# EAGLE design sensors_f (EAGLE 9.6.2)
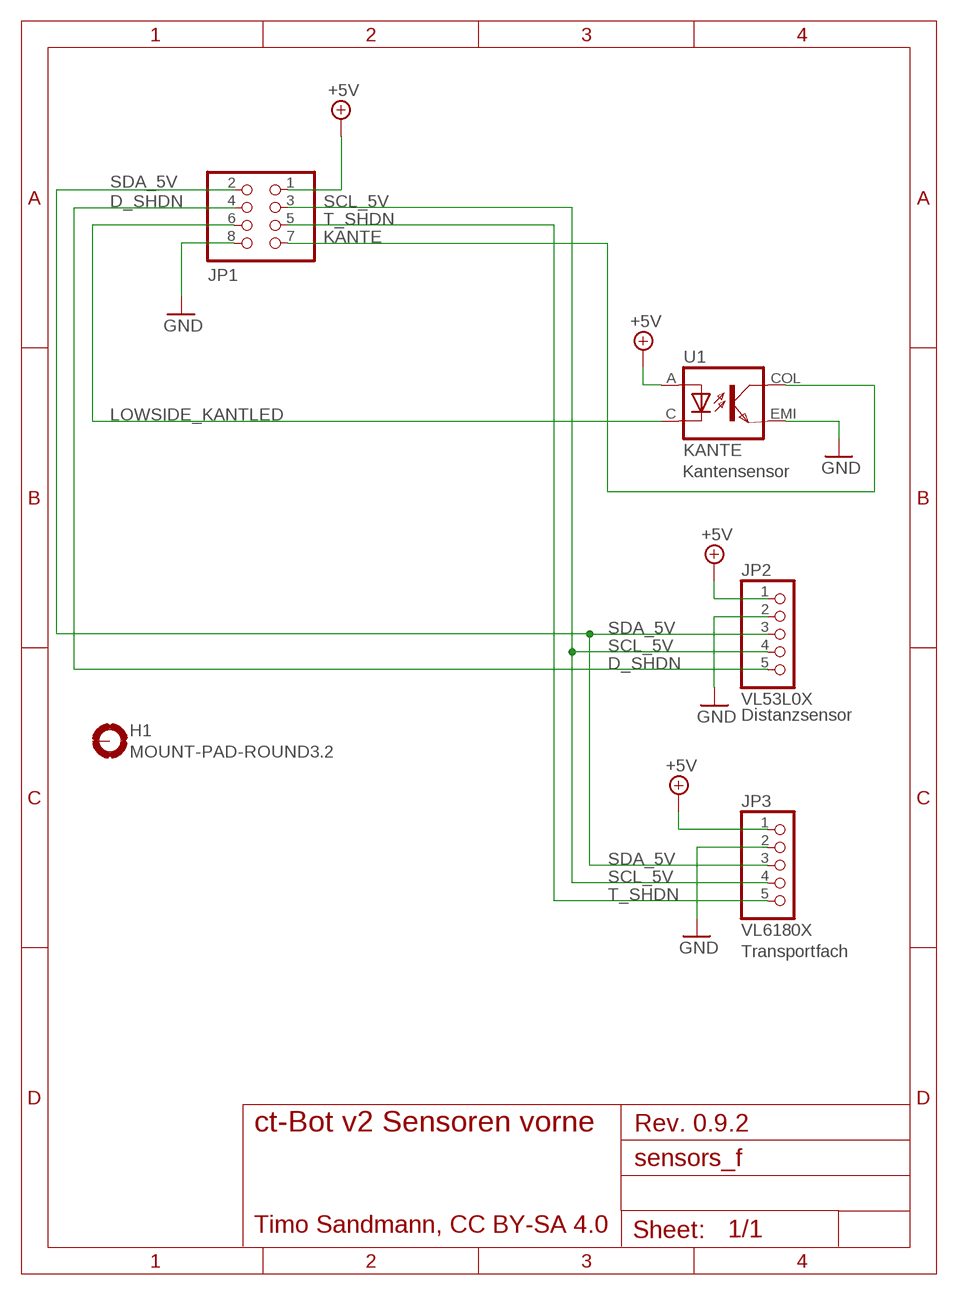
[diagram p0: schematic, sheet 1]

## Parts
H1  MOUNT-PAD-ROUND3.2  [3,2-PAD]
JP1  PINHD-2X4  [2X04]
JP2  VL53L0X  PINHD-1X5  [1X05]
JP3  VL6180X  PINHD-1X5  [1X05]
U1  KANTE  CNY70  [EDGE]

## Nets
+5V: JP1.1 JP2.1 JP3.1 U1.A
D_SHDN: JP1.4 JP2.5
GND: JP1.8 JP2.2 JP3.2 U1.EMI
KANTE: JP1.7 U1.COL
LOWSIDE_KANTLED: JP1.6 U1.C
SCL_5V: JP1.3 JP2.4 JP3.4
SDA_5V: JP1.2 JP2.3 JP3.3
T_SHDN: JP1.5 JP3.5
Unconnected: H1.B3,2(MOUNT)

## Notes on the sheet
- Kantensensor
- Distanzsensor
- Transportfach
- Rev. 0.9.2
- ct-Bot v2 Sensoren vorne
- Timo Sandmann, CC BY-SA 4.0

## Library data of the parts
H1 = holes:MOUNT-PAD-ROUND: MOUNTING PAD, round
JP1 = ct-bot:PINHD-2X4: PIN HEADER
JP2 JP3 = ct-bot:PINHD-1X5: PIN HEADER
U1 = ct-bot:CNY70

## Board
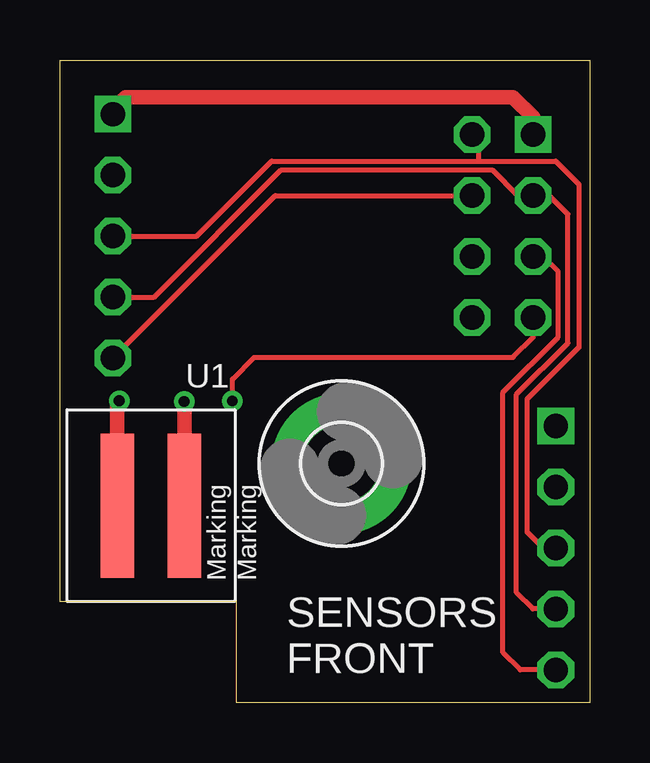
[diagram p1: board, top side]
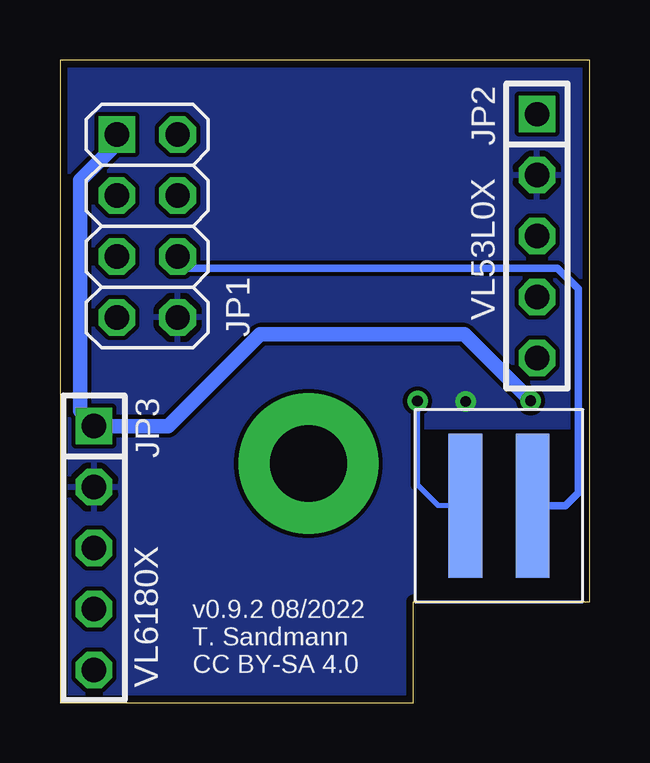
[diagram p2: board, bottom side, seen from below]

Size 22.1 x 26.77 mm. Coordinates in mm from the lower left corner, seen from the top.
Outline: 22.1,0 7.37,0 7.37,4.19 0,4.19 0,26.77 22.1,26.77 22.1,0
Copper layers (1*16): Top 0.035mm / dielectric 1.5mm / Bottom 0.035mm
Design rules "aisler_2_layer_simple": minimum track width 0.2mm, minimum drill 0.45mm, track to track 0.175mm, track to pad 0.175mm, pad to pad 0.175mm, via to via 0.175mm, smd to smd 0.175mm, copper to edge 0.3mm, drill to drill 0.25mm, minimum pad ring 0.2mm, minimum via ring 0.2mm, stop-mask expansion 0mil, vias tented up to drill 0mil, thermal gap 10mil

### Footprints (pad centres in the part's own frame; a part is rotated, then mirrored left to right if it is on the bottom)
3,2-PAD = drill 3.2 pad 5.842: B3,2 0,0
2X04 = drill 1.016 square: 1 -3.81,-1.27 | drill 1.016 octagon: 2 -3.81,1.27; 3 -1.27,-1.27; 4 -1.27,1.27; 5 1.27,-1.27; 6 1.27,1.27; 7 3.81,-1.27; 8 3.81,1.27
1X05 = drill 1.016 square: 1 -5.08,0 | drill 1.016 octagon: 2 -2.54,0; 3 0,0; 4 2.54,0; 5 5.08,0
EDGE = smd 1.4 x 6: A 0,0; EMI 2.8,0 | smd 1.4 x 6 bottom: C 0,0; COL 2.8,0

### Placement (x,y rotation side)
H1  11.74,9.96 0 top
JP1  18.46,19.85 270 bottom
JP2  2.2,19.43 270 bottom
JP3  20.68,6.44 270 bottom
U1  2.39,8.21 0 top

### Tracks (layer width: path | path; a pad name or v marks a point on that pad's centre or on a via)
+5V  (via drill 0.45)
  Top 0.61: U1.A 2.39,12.5 v2.47,12.57 | JP2.1 2.2,24.7 2.73,25.23 18.88,25.23 19.73,24.38 JP1.1
  Bottom 0.61: JP1.1 19.73,23.29 21.27,21.76 21.27,12.16 20.68,11.57 JP3.1 17.58,11.52 13.75,15.34 5.24,15.34 v2.47,12.57
D_SHDN
  Top 0.203: JP2.5 8.97,21.12 JP1.4
GND  (via drill 0.45)
  Top 0.61: U1.EMI 5.19,12.53 v5.18,12.54
  pour Bottom (rank 6): 22.63,27.1 -0.46,27.1 -0.46,-0.29 22.63,-0.29
KANTE  (via drill 0.45)
  Top 0.203: v7.19,12.56 7.19,13.48 8.09,14.38 18.89,14.38 19.73,15.22 JP1.7
  Bottom 0.203: U1.COL 6.32,8.21 7.19,9.08 v7.19,12.56
LOWSIDE_KANTLED
  Bottom 0.305: U1.C 1.02,8.21 0.49,8.74 0.49,17.23 1.35,18.09 16.88,18.09 17.19,18.4 JP1.6
N$1
  cutout Bottom: 7.24,11.3 0.28,11.3 0.28,4.21 7.24,4.21
SCL_5V
  Top 0.203: JP2.4 3.92,16.89 9.19,22.17 18.06,22.17 19.1,21.12 JP1.3 20.4,21.12 21.18,20.35 21.18,14.97 19.04,12.83 19.04,4.58 19.72,3.9 JP3.4
SDA_5V
  Top 0.203: JP3.3 20.16,6.44 19.48,7.12 19.48,12.64 21.64,14.8 21.64,21.59 20.67,22.56 17.44,22.56 | 17.44,22.56 8.83,22.56 5.71,19.43 JP2.3 | JP1.2 17.44,23.41 17.44,22.56
T_SHDN
  Top 0.203: JP3.5 19.19,1.36 18.47,2.08 18.47,12.93 20.77,15.23 20.77,17.95 20.14,18.58 JP1.5

### Text on the board
tNames: SENSORS / FRONT
bNames: VL53L0X | v0.9.2 08/2022 / T. Sandmann / CC BY-SA 4.0 | VL6180X